# Altium schematic sheet LED.SchDoc: LED
size A3; Author: Silvio Navaretti; CompanyName: ARDUINO; DrawnBy: Silvio Navaretti; Engineer: Silvio Navaretti; Organization: ARDUINO; SheetNumber: 14; SheetTotal: 51; RevAuthor: Silvio Navaretti
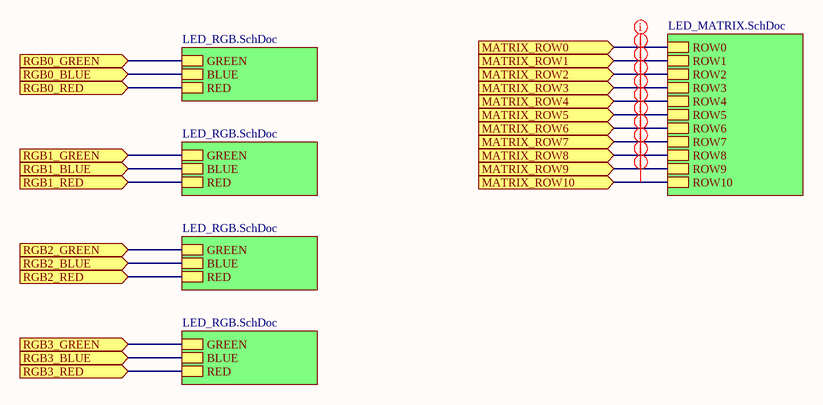
[diagram p0: LED.SchDoc]

## Sub-sheets
U_LED_MATRIX = LED_MATRIX.SchDoc: ROW0, ROW1, ROW2, ROW3, ROW4, ROW5, ROW6, ROW7, ROW8, ROW9, ROW10
U_LED_RGB = LED_RGB.SchDoc: GREEN, BLUE, RED
U_LED_RGB = LED_RGB.SchDoc: GREEN, BLUE, RED
U_LED_RGB = LED_RGB.SchDoc: GREEN, BLUE, RED
U_LED_RGB = LED_RGB.SchDoc: GREEN, BLUE, RED

## Ports
MATRIX_ROW0 (in), MATRIX_ROW1 (in), MATRIX_ROW2 (in), MATRIX_ROW3 (in), MATRIX_ROW4 (in), MATRIX_ROW5 (in), MATRIX_ROW6 (in), MATRIX_ROW7 (in), MATRIX_ROW8 (in), MATRIX_ROW9 (in), MATRIX_ROW10 (in), RGB0_BLUE (in), RGB0_GREEN (in), RGB0_RED (in), RGB1_BLUE (in), RGB1_GREEN (in), RGB1_RED (in), RGB2_BLUE (in), RGB2_GREEN (in), RGB2_RED (in), RGB3_BLUE (in), RGB3_GREEN (in), RGB3_RED (in)

## Nets
MATRIX_ROW0: port MATRIX_ROW0, sheet U_LED_MATRIX/ROW0
MATRIX_ROW1: port MATRIX_ROW1, sheet U_LED_MATRIX/ROW1
MATRIX_ROW2: port MATRIX_ROW2, sheet U_LED_MATRIX/ROW2
MATRIX_ROW3: port MATRIX_ROW3, sheet U_LED_MATRIX/ROW3
MATRIX_ROW4: port MATRIX_ROW4, sheet U_LED_MATRIX/ROW4
MATRIX_ROW5: port MATRIX_ROW5, sheet U_LED_MATRIX/ROW5
MATRIX_ROW6: port MATRIX_ROW6, sheet U_LED_MATRIX/ROW6
MATRIX_ROW7: port MATRIX_ROW7, sheet U_LED_MATRIX/ROW7
MATRIX_ROW8: port MATRIX_ROW8, sheet U_LED_MATRIX/ROW8
MATRIX_ROW9: port MATRIX_ROW9, sheet U_LED_MATRIX/ROW9
MATRIX_ROW10: port MATRIX_ROW10, sheet U_LED_MATRIX/ROW10
RGB0_BLUE: port RGB0_BLUE, sheet U_LED_RGB/BLUE
RGB0_GREEN: port RGB0_GREEN, sheet U_LED_RGB/GREEN
RGB0_RED: port RGB0_RED, sheet U_LED_RGB/RED
RGB1_BLUE: port RGB1_BLUE, sheet U_LED_RGB/BLUE
RGB1_GREEN: port RGB1_GREEN, sheet U_LED_RGB/GREEN
RGB1_RED: port RGB1_RED, sheet U_LED_RGB/RED
RGB2_BLUE: port RGB2_BLUE, sheet U_LED_RGB/BLUE
RGB2_GREEN: port RGB2_GREEN, sheet U_LED_RGB/GREEN
RGB2_RED: port RGB2_RED, sheet U_LED_RGB/RED
RGB3_BLUE: port RGB3_BLUE, sheet U_LED_RGB/BLUE
RGB3_GREEN: port RGB3_GREEN, sheet U_LED_RGB/GREEN
RGB3_RED: port RGB3_RED, sheet U_LED_RGB/RED

## Layout directives
net class MICROCONTROLLER_MATRIX: MATRIX_ROW0, MATRIX_ROW1, MATRIX_ROW2, MATRIX_ROW3, MATRIX_ROW4, MATRIX_ROW5, MATRIX_ROW6, MATRIX_ROW7, MATRIX_ROW8, MATRIX_ROW9, MATRIX_ROW10

## Notes on the sheet
- Title:
- ID:
- Date:
- Time:
- Version:
- Sheet
- of
- RevAuthor:
- Reference Designs ARE PROVIDED "AS IS" AND "WITH ALL FAULTS. Arduino SA DISCLAIMS ALL OTHER WARRANTIES, EXPRESS OR IMPLIED, REGARDING PRODUCTS, INCLUDING BUT NOT LIMITED TO, ANY IMPLIED WARRANTIES OF MERCHANTABILITY OR FITNESS FOR A PARTICULAR PURPOSE.
  Arduino SA may make changes to specifications and product descriptions at any time, without notice. The Customer must not rely on the absence or characteristics of any features or instructions marked "reserved" or "undefined".
  Arduino SA reserves these for future definition and shall have no responsibility whatsoever for conflicts or incompatibilities arising from future changes to them. The product information on the Web Site or Materials is subject to change without notice.
  Do not finalize a design with this info. ARDUINO and other Arduino brands and logos and Trademarks of Arduino SA. All Arduino SA Trademarks cannot be used without owner's formal permission.
- File:
- Author: